# EAGLE design 8rgb-shifter (EAGLE 6.4)
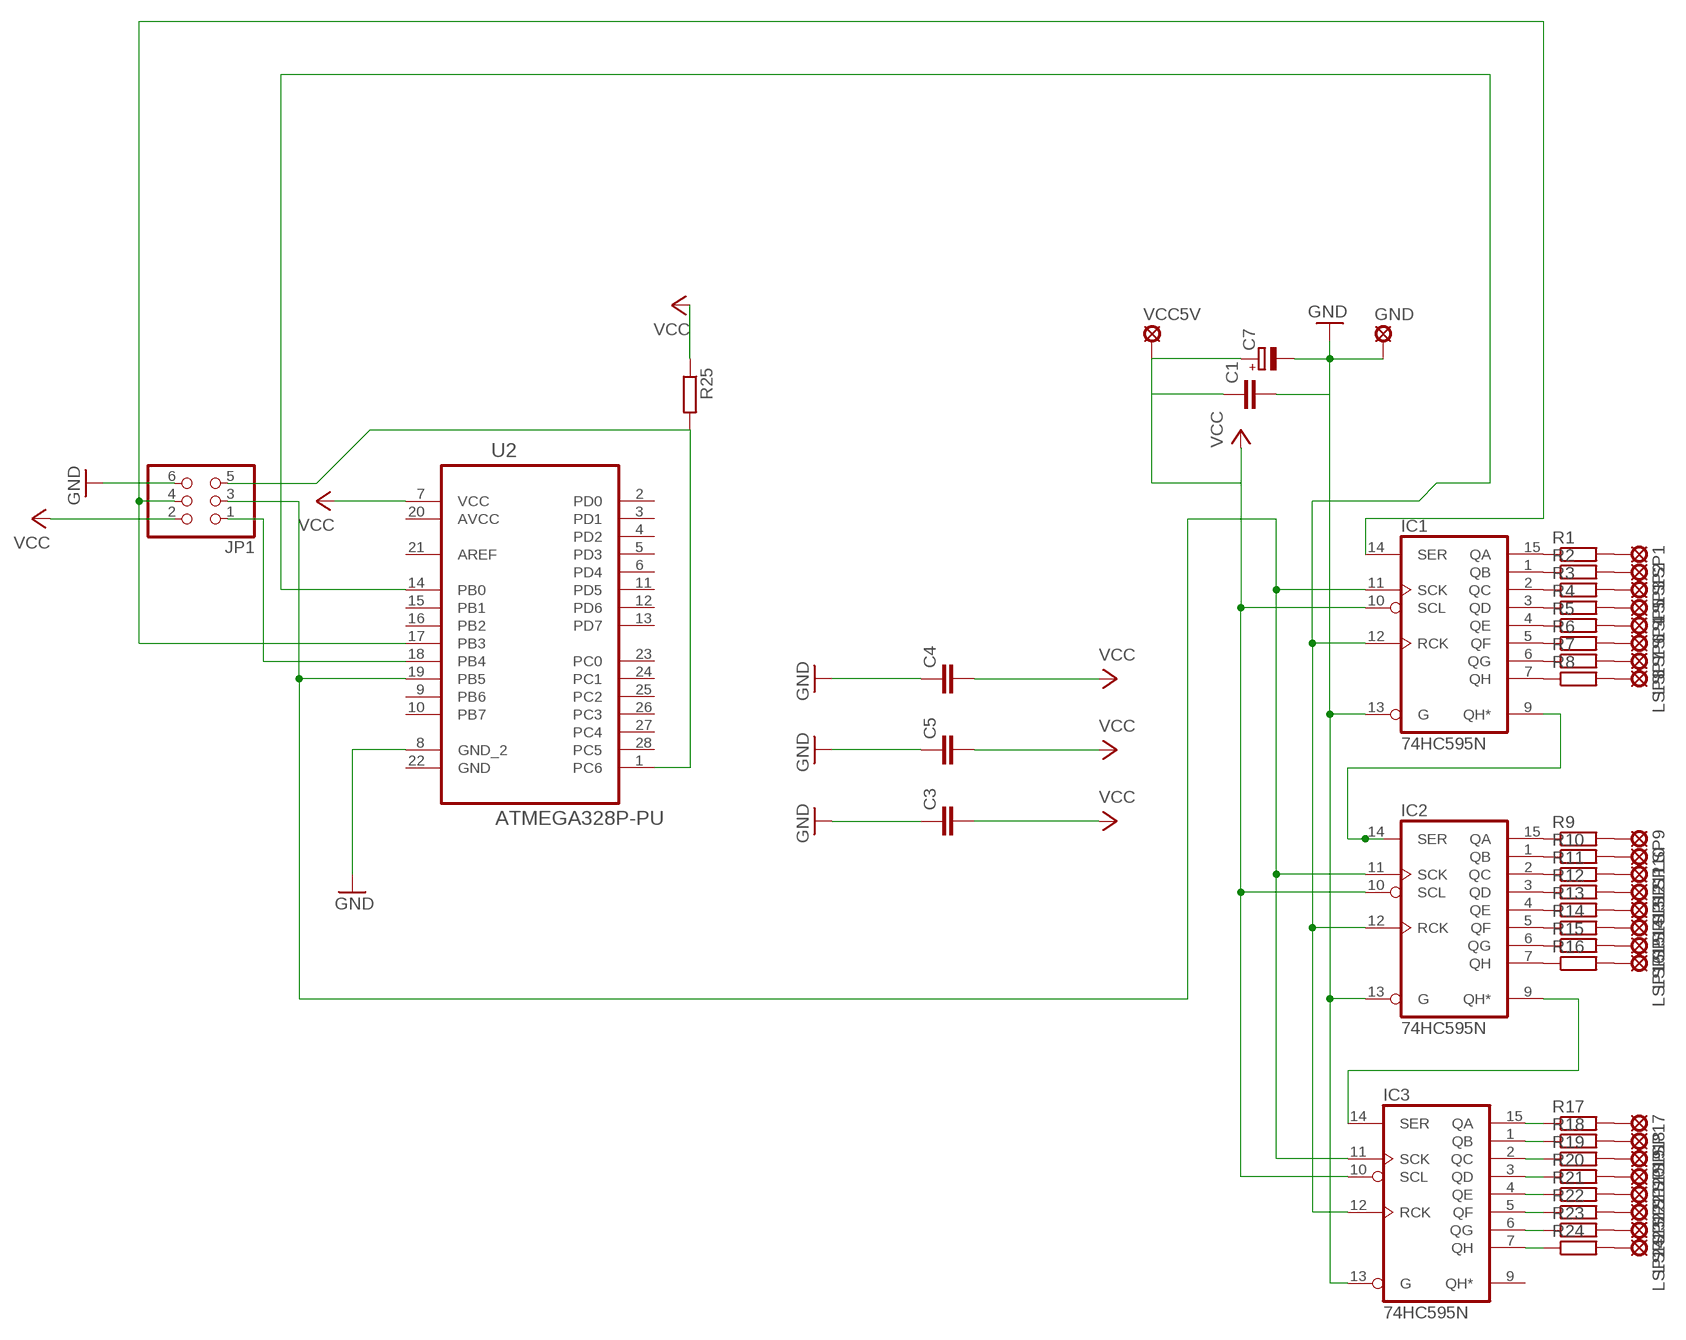
[diagram p0: schematic, sheet 1]

## Parts
C1  C-EU025-025X050  [C025-025X050]
C3  C-EU025-025X050  [C025-025X050]
C4  C-EU025-025X050  [C025-025X050]
C5  C-EU025-025X050  [C025-025X050]
C7  CPOL-EUE2,5-6E  [E2,5-6E]
GND  LSP10  [LSP10]
IC1  74HC595N  [DIL16]
IC2  74HC595N  [DIL16]
IC3  74HC595N  [DIL16]
JP1  PINHD-2X3  [2X03]
LSP1  LSP10  [LSP10]
LSP2  LSP10  [LSP10]
LSP3  LSP10  [LSP10]
LSP4  LSP10  [LSP10]
LSP5  LSP10  [LSP10]
LSP6  LSP10  [LSP10]
LSP7  LSP10  [LSP10]
LSP8  LSP10  [LSP10]
LSP9  LSP10  [LSP10]
LSP10  LSP10  [LSP10]
LSP11  LSP10  [LSP10]
LSP12  LSP10  [LSP10]
LSP13  LSP10  [LSP10]
LSP14  LSP10  [LSP10]
LSP15  LSP10  [LSP10]
LSP16  LSP10  [LSP10]
LSP17  LSP10  [LSP10]
LSP18  LSP10  [LSP10]
LSP19  LSP10  [LSP10]
LSP20  LSP10  [LSP10]
LSP21  LSP10  [LSP10]
LSP22  LSP10  [LSP10]
LSP23  LSP10  [LSP10]
LSP24  LSP10  [LSP10]
R1  R-EU_0204/2V  [0204V]
R2  R-EU_0204/2V  [0204V]
R3  R-EU_0204/2V  [0204V]
R4  R-EU_0204/2V  [0204V]
R5  R-EU_0204/2V  [0204V]
R6  R-EU_0204/2V  [0204V]
R7  R-EU_0204/2V  [0204V]
R8  R-EU_0204/2V  [0204V]
R9  R-EU_0204/2V  [0204V]
R10  R-EU_0204/2V  [0204V]
R11  R-EU_0204/2V  [0204V]
R12  R-EU_0204/2V  [0204V]
R13  R-EU_0204/2V  [0204V]
R14  R-EU_0204/2V  [0204V]
R15  R-EU_0204/2V  [0204V]
R16  R-EU_0204/2V  [0204V]
R17  R-EU_0204/2V  [0204V]
R18  R-EU_0204/2V  [0204V]
R19  R-EU_0204/2V  [0204V]
R20  R-EU_0204/2V  [0204V]
R21  R-EU_0204/2V  [0204V]
R22  R-EU_0204/2V  [0204V]
R23  R-EU_0204/2V  [0204V]
R24  R-EU_0204/2V  [0204V]
R25  R-EU_0204/7  [0204/7]
U2  ATMEGA328P-PU  [DIP254P762X457-28]
VCC5V  LSP10  [LSP10]

## Nets
GND: C4.1 JP1.6 U2.8(GND_2)
N$1: JP1.1 U2.18(PB4)
N$2: IC1.11(SCK) IC2.11(SCK) IC3.11(SCK) JP1.3 U2.19(PB5)
N$3: LSP1.MP R1.2
N$4: IC1.9(QH*) IC2.14(SER)
N$5: IC2.9(QH*) IC3.14(SER)
N$6: LSP17.MP R17.2
N$7: JP1.5 R25.2 U2.1(PC6)
N$8: IC1.14(SER) JP1.4 U2.17(PB3)
N$10: IC1.15(QA) R1.1
N$12: IC1.1(QB) R2.1
N$13: IC1.2(QC) R3.1
N$14: IC1.3(QD) R4.1
N$15: IC1.4(QE) R5.1
N$16: IC1.5(QF) R6.1
N$17: IC1.6(QG) R7.1
N$18: IC1.7(QH) R8.1
N$19: IC2.15(QA) R9.1
N$20: IC2.1(QB) R10.1
N$21: IC2.2(QC) R11.1
N$22: IC2.3(QD) R12.1
N$23: IC2.4(QE) R13.1
N$24: IC2.5(QF) R14.1
N$25: IC2.6(QG) R15.1
N$26: IC2.7(QH) R16.1
N$27: IC3.15(QA) R17.1
N$28: IC3.1(QB) R18.1
N$29: IC3.2(QC) R19.1
N$30: IC3.3(QD) R20.1
N$31: IC3.4(QE) R21.1
N$32: IC3.5(QF) R22.1
N$33: IC3.6(QG) R23.1
N$34: IC3.7(QH) R24.1
N$57: LSP2.MP R2.2
N$58: LSP3.MP R3.2
N$59: LSP4.MP R5.2
N$60: LSP5.MP R4.2
N$61: LSP6.MP R6.2
N$62: LSP7.MP R7.2
N$63: LSP8.MP R8.2
N$64: LSP9.MP R9.2
N$65: LSP10.MP R10.2
N$66: LSP12.MP R12.2
N$67: LSP13.MP R13.2
N$68: LSP14.MP R14.2
N$69: LSP15.MP R15.2
N$70: LSP11.MP R11.2
N$71: LSP16.MP R16.2
N$72: LSP18.MP R18.2
N$73: LSP19.MP R19.2
N$74: LSP20.MP R20.2
N$75: LSP21.MP R21.2
N$76: LSP23.MP R23.2
N$77: LSP24.MP R24.2
N$78: LSP22.MP R22.2
N$104: C1.2 C3.1 C5.1 C7.- GND.MP IC1.13(G) IC2.13(G) IC3.13(G) ; supply symbol labelled GND
N$110: IC1.12(RCK) IC2.12(RCK) IC3.12(RCK) U2.14(PB0)
VCC: C1.1 C3.2 C4.2 C5.2 C7.+ IC1.10(SCL) IC2.10(SCL) IC3.10(SCL) JP1.2 R25.1 U2.7(VCC) VCC5V.MP
Unconnected: IC3.9(QH*) U2.2(PD0) U2.3(PD1) U2.4(PD2) U2.5(PD3) U2.6(PD4) U2.9(PB6) U2.10(PB7) U2.11(PD5) U2.12(PD6) U2.13(PD7) U2.15(PB1) U2.16(PB2) U2.21(AREF) U2.22(GND) U2.23(PC0) U2.24(PC1) U2.25(PC2) U2.26(PC3) U2.27(PC4) U2.28(PC5)

## Power pins joined to a net without a drawn wire
AVCC: U2.20(AVCC)
N$104: IC1.8(GND) IC2.8(GND) IC3.8(GND)
VCC: IC1.16(VCC) IC2.16(VCC) IC3.16(VCC)

## Library data of the parts
C1 C3-C5 = resistor:C-EU: CAPACITOR, European symbol
C7 = rcl:CPOL-EU: POLARIZED CAPACITOR, European symbol
GND LSP1-LSP24 VCC5V = solpad:LSP10: SOLDER PAD drill 1.0 mm, distributor Buerklin, 12H555
IC1-IC3 = 74xx-eu:74*595: 8-bit SHIFT REGISTER, output latch
JP1 = pinhead:PINHD-2X3: PIN HEADER
R1-R24 = rcl:R-EU_: RESISTOR, European symbol
R25 = resistor:R-EU_: RESISTOR, European symbol
U2 = Atmel_By_element14_Batch_1:ATMEGA328P-PU: 8-bit Microcontroller with In-System Programmable Flash; MPN: ATMEGA328P-PU; OC_FARNELL: 1715487; OC_NEWARK: 15R0268; PACKAGE: PDIP-28; SUPPLIER: Atmel

## Board
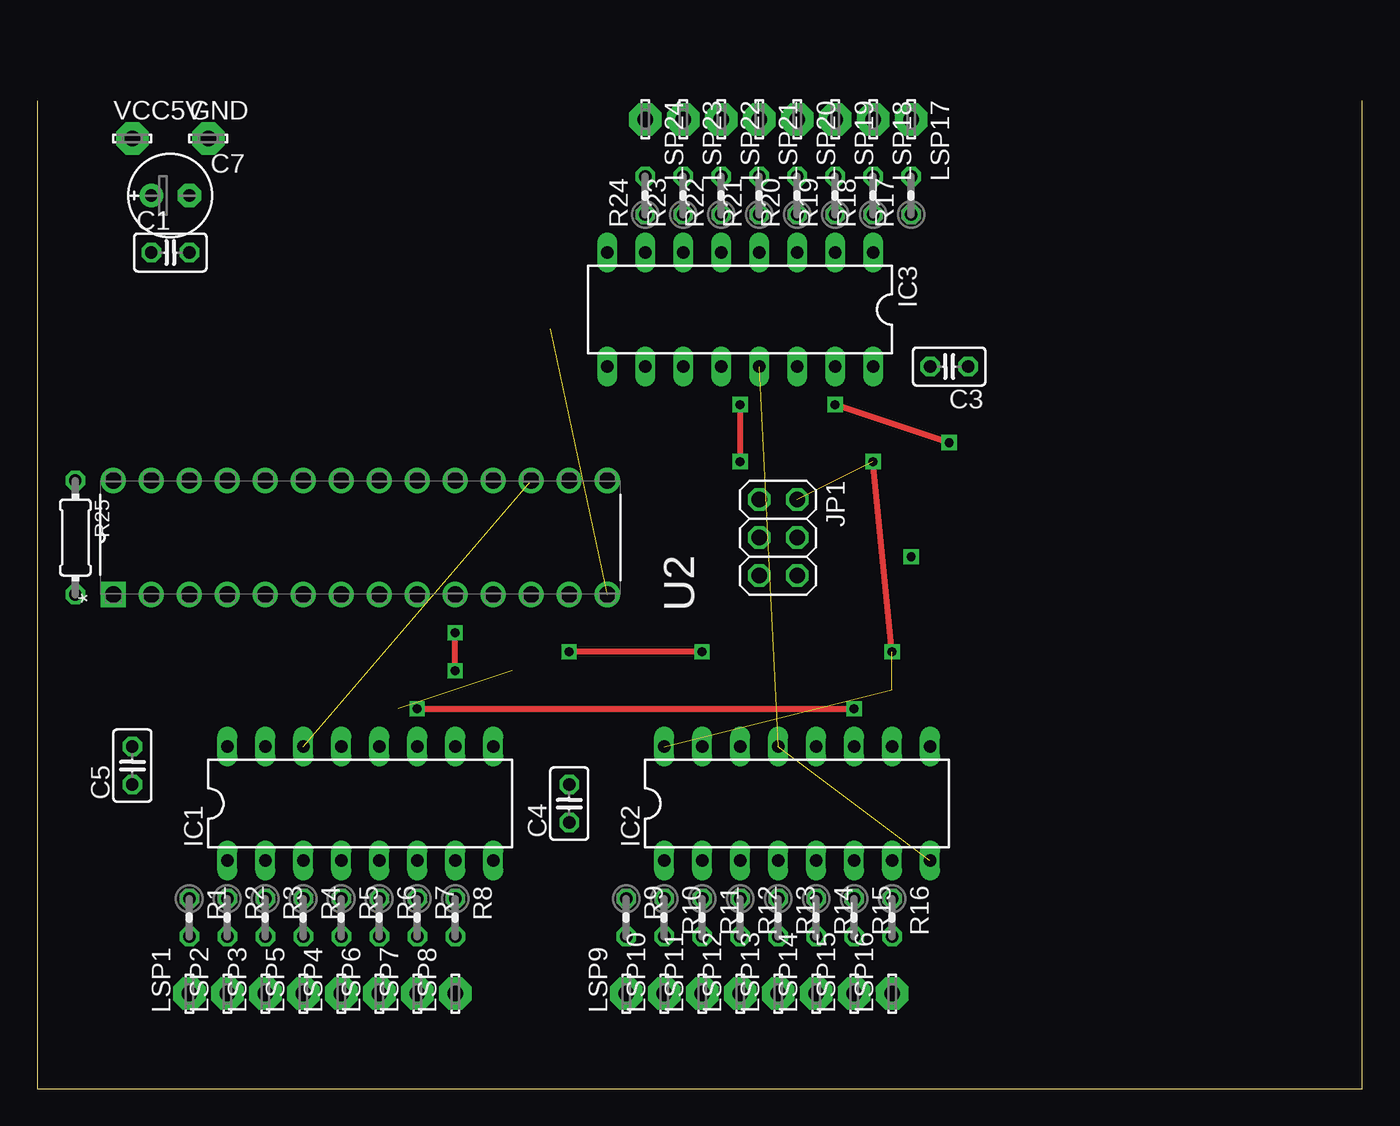
[diagram p1: board, top side]
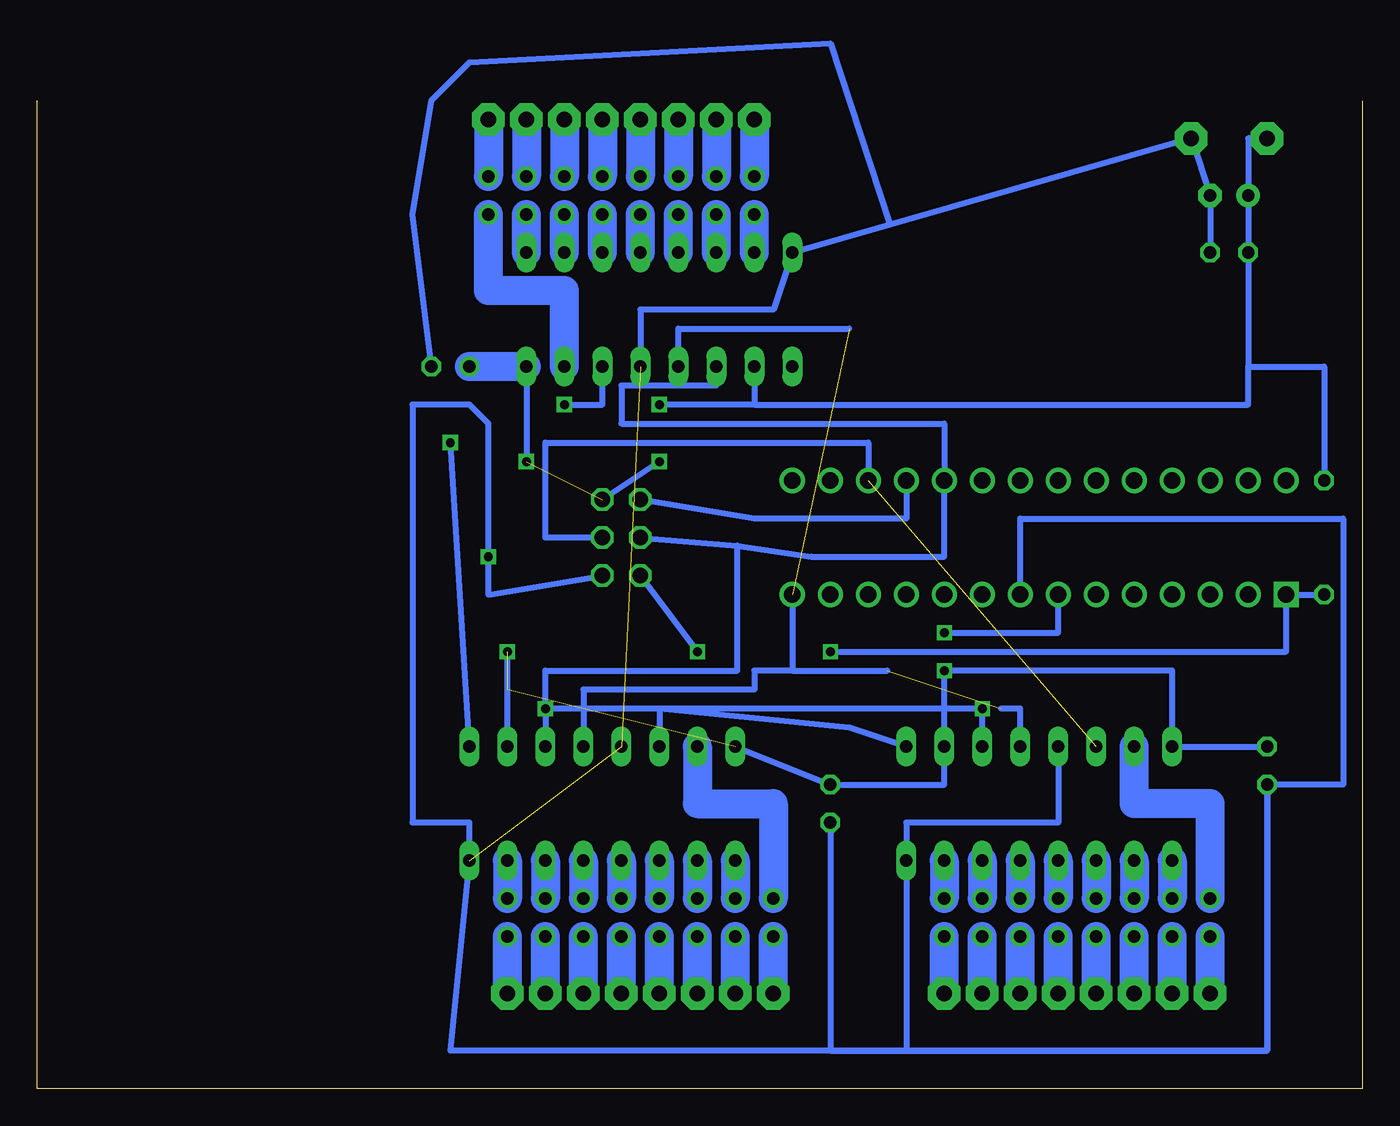
[diagram p2: board, bottom side, seen from below]

Size 88.57 x 66.03 mm. Coordinates in mm from the lower left corner, seen from the top.
Outline: 88.57,66.03 88.57,0 0,0 0,66.03
Copper layers (1*16): Top 0.035mm / dielectric 1.5mm / Bottom 0.035mm
Design rules "default *": minimum track width 10mil, minimum drill 24mil, track to track 8mil, track to pad 8mil, pad to pad 8mil, via to via 8mil, smd to smd 8mil, copper to edge 40mil, drill to drill 8mil, minimum pad ring 10mil, minimum via ring 8mil, stop-mask expansion 4mil, vias tented up to drill 0mil, thermal gap 10mil

### Footprints (pad centres in the part's own frame; a part is rotated, then mirrored left to right if it is on the bottom)
C025-025X050 = drill 0.813 octagon: 1 -1.27,0; 2 1.27,0
E2,5-6E = drill 0.813 pad 1.575: + -1.27,0 | drill 0.813 pad 1.575 octagon: - 1.27,0
LSP10 = drill 1.016 pad 2.159 octagon: MP 0,0
DIL16 = drill 0.813 long: 1 -8.89,-3.81; 2 -6.35,-3.81; 3 -3.81,-3.81; 4 -1.27,-3.81; 5 1.27,-3.81; 6 3.81,-3.81; 7 6.35,-3.81; 8 8.89,-3.81; 9 8.89,3.81; 10 6.35,3.81; 11 3.81,3.81; 12 1.27,3.81; 13 -1.27,3.81; 14 -3.81,3.81; 15 -6.35,3.81; 16 -8.89,3.81
2X03 = drill 1.016 octagon: 1 -2.54,-1.27; 2 -2.54,1.27; 3 0,-1.27; 4 0,1.27; 5 2.54,-1.27; 6 2.54,1.27
0204V = drill 0.813 octagon: 1 -1.27,0; 2 1.27,0
0204/7 = drill 0.813 octagon: 1 -3.81,0; 2 3.81,0
DIP254P762X457-28 = drill 1.118 square: 1 -7.62,33.02 | drill 1.118: 2 -7.62,30.48; 3 -7.62,27.94; 4 -7.62,25.4; 5 -7.62,22.86; 6 -7.62,20.32; 7 -7.62,17.78; 8 -7.62,15.24; 9 -7.62,12.7; 10 -7.62,10.16; 11 -7.62,7.62; 12 -7.62,5.08; 13 -7.62,2.54; 14 -7.62,0; 15 0,0; 16 0,2.54; 17 0,5.08; 18 0,7.62; 19 0,10.16; 20 0,12.7; 21 0,15.24; 22 0,17.78; 23 0,20.32; 24 0,22.86; 25 0,25.4; 26 0,27.94; 27 0,30.48; 28 0,33.02

### Placement (x,y rotation side)
C1  8.89,55.88 0 top
C3  60.96,48.26 180 top
C4  35.56,19.05 90 top
C5  6.35,21.59 90 top
C7  8.89,59.69 0 top
GND  11.43,63.5 0 top
IC1  21.59,19.05 0 top
IC2  50.8,19.05 0 top
IC3  46.99,52.07 180 top
JP1  49.53,36.83 270 top
LSP1  10.16,6.35 90 top
LSP2  12.7,6.35 90 top
LSP3  15.24,6.35 90 top
LSP4  20.32,6.35 90 top
LSP5  17.78,6.35 90 top
LSP6  22.86,6.35 90 top
LSP7  25.4,6.35 90 top
LSP8  27.94,6.35 90 top
LSP9  39.37,6.35 90 top
LSP10  41.91,6.35 90 top
LSP11  44.45,6.35 90 top
LSP12  46.99,6.35 90 top
LSP13  49.53,6.35 90 top
LSP14  52.07,6.35 90 top
LSP15  54.61,6.35 90 top
LSP16  57.15,6.35 90 top
LSP17  58.42,64.77 270 top
LSP18  55.88,64.77 270 top
LSP19  53.34,64.77 270 top
LSP20  50.8,64.77 270 top
LSP21  48.26,64.77 270 top
LSP22  45.72,64.77 270 top
LSP23  43.18,64.77 270 top
LSP24  40.64,64.77 270 top
R1  10.16,11.43 270 top
R2  12.7,11.43 270 top
R3  15.24,11.43 270 top
R4  17.78,11.43 270 top
R5  20.32,11.43 270 top
R6  22.86,11.43 270 top
R7  25.4,11.43 270 top
R8  27.94,11.43 270 top
R9  39.37,11.43 270 top
R10  41.91,11.43 270 top
R11  44.45,11.43 270 top
R12  46.99,11.43 270 top
R13  49.53,11.43 270 top
R14  52.07,11.43 270 top
R15  54.61,11.43 270 top
R16  57.15,11.43 270 top
R17  58.42,59.69 90 top
R18  55.88,59.69 90 top
R19  53.34,59.69 90 top
R20  50.8,59.69 90 top
R21  48.26,59.69 90 top
R22  45.72,59.69 90 top
R23  43.18,59.69 90 top
R24  40.64,59.69 90 top
R25  2.54,36.83 270 top
U2  38.1,40.64 90 top
VCC5V  6.35,63.5 0 top

### Tracks (layer width: path | path; a pad name or v marks a point on that pad's centre or on a via)
GND
  Bottom 0.406: U2.8 22.86,38.1 1.27,38.1 1.27,20.32 6.35,20.32 6.35,2.54 35.56,2.54 | C4.1 35.56,2.54 | 35.56,2.54 60.96,2.54 59.69,15.24 59.69,17.78 63.5,17.78 63.5,45.72 59.69,45.72 58.42,44.45 58.42,33.02 JP1.6
N$1
  Bottom 0.406: U2.18 30.48,38.1 40.64,38.1 JP1.1
N$2  (via drill 0.6)
  Top 0.406: v25.4,25.4 v54.61,25.4
  Bottom 0.406: JP1.3 41.76,36.29 | 41.76,36.29 36.83,35.56 27.94,35.56 U2.19 27.94,44.45 49.53,44.45 49.53,46.99 43.18,46.99 IC3.11 | IC1.11 v25.4,25.4 v54.61,25.4 | v54.61,25.4 IC2.11 | v54.61,25.4 54.61,27.94 41.76,27.94 41.76,36.29
N$3
  Bottom 1.93: LSP1.MP R1.2
N$4
  Bottom 0.406: IC1.9 34.29,24.13 46.99,25.4 IC2.14
N$5  (via drill 0.6)
  Top 0.406: v60.96,43.18 v53.34,45.72
  Bottom 0.406: IC2.9 v60.96,43.18 | v53.34,45.72 50.8,45.72 IC3.14
N$6
  Bottom 1.93: LSP17.MP R17.2
N$7  (via drill 0.6)
  Top 0.406: v44.45,29.21 v35.56,29.21
  Bottom 0.406: R25.2 U2.1 5.08,29.21 v35.56,29.21 | JP1.5 v44.45,29.21
N$8  (1 unrouted)
  Bottom 0.406: JP1.4 54.61,36.83 54.61,43.18 33.02,43.18 U2.17
N$10
  Bottom 1.93: R1.1 10.16,19.05 15.24,19.05 IC1.15
N$11  (via drill 0.6)
  other vias: 58.42,35.56
N$12
  Bottom 1.93: IC1.1 R2.1
N$13
  Bottom 1.93: IC1.2 R3.1
N$14
  Bottom 1.93: IC1.3 R4.1
N$15
  Bottom 1.93: IC1.4 R5.1
N$16
  Bottom 1.93: IC1.5 R6.1
N$17
  Bottom 1.93: IC1.6 R7.1
N$18
  Bottom 1.93: IC1.7 R8.1
N$19
  Bottom 1.93: IC2.15 44.45,19.05 39.37,19.05 R9.1
N$20
  Bottom 1.93: IC2.1 R10.1
N$21
  Bottom 1.93: IC2.2 R11.1
N$22
  Bottom 1.93: IC2.3 R12.1
N$23
  Bottom 1.93: IC2.4 R13.1
N$24
  Bottom 1.93: IC2.5 R14.1
N$25
  Bottom 1.93: IC2.6 R15.1
N$26
  Bottom 1.93: IC2.7 R16.1
N$27
  Bottom 1.93: IC3.15 53.34,53.34 58.42,53.34 R17.1
N$28
  Bottom 1.93: IC3.1 R18.1
N$29
  Bottom 1.93: IC3.2 R19.1
N$30
  Bottom 1.93: IC3.3 R20.1
N$31
  Bottom 1.93: IC3.4 R21.1
N$32
  Bottom 1.93: IC3.5 R22.1
N$33
  Bottom 1.93: IC3.6 R23.1
N$34
  Bottom 1.93: IC3.7 R24.1
N$57
  Bottom 1.93: LSP2.MP R2.2
N$58
  Bottom 1.93: LSP3.MP R3.2
N$59
  Bottom 1.93: LSP4.MP R5.2
N$60
  Bottom 1.93: LSP5.MP R4.2
N$61
  Bottom 1.93: LSP6.MP R6.2
N$62
  Bottom 1.93: LSP7.MP R7.2
N$63
  Bottom 1.93: LSP8.MP R8.2
N$64
  Bottom 1.93: LSP9.MP R9.2
N$65
  Bottom 1.93: LSP10.MP R10.2
N$66
  Bottom 1.93: LSP12.MP R12.2
N$67
  Bottom 1.93: LSP13.MP R13.2
N$68
  Bottom 1.93: LSP14.MP R14.2
N$69
  Bottom 1.93: LSP15.MP R15.2
N$70
  Bottom 1.93: LSP11.MP R11.2
N$71
  Bottom 1.93: LSP16.MP R16.2
N$72
  Bottom 1.93: LSP18.MP R18.2
N$73
  Bottom 1.93: LSP19.MP R19.2
N$74
  Bottom 1.93: LSP20.MP R20.2
N$75
  Bottom 1.93: LSP21.MP R21.2
N$76
  Bottom 1.93: LSP23.MP R23.2
N$77
  Bottom 1.93: LSP24.MP R24.2
N$78
  Bottom 1.93: LSP22.MP R22.2
N$104  (2 unrouted)
  Bottom 0.406: C5.1 6.35,2.54 30.48,2.54 | IC1.13 20.32,17.78 30.48,17.78 IC1.8 30.48,2.54 | 30.48,2.54 60.96,2.54 IC2.8 | C1.2 C7.- GND.MP 31.56,57.75 | 31.56,57.75 IC3.8 39.37,52.07 48.26,52.07 IC3.13 | C3.1 63.5,58.42 62.23,66.04 59.69,68.58 35.56,69.85 31.56,57.75
N$110  (2 unrouted)
  Bottom 0.406: IC1.12 22.86,25.4 24.13,25.4 | 38.1,27.94 31.75,27.94 | U2.14 38.1,27.94 | 38.1,27.94 40.64,27.94 40.64,26.67 52.07,26.67 IC2.12 | IC3.12 45.72,50.8 34.29,50.8
VCC  (via drill 0.6)  (3 unrouted)
  Top 0.406: v57.15,29.21 v55.88,41.91 | v27.94,27.94 v27.94,30.48 | v46.99,45.72 v46.99,41.91
  Bottom 0.406: VCC5V.MP 7.62,63.5 C7.+ C1.1 7.62,48.26 | C5.2 IC1.16 12.7,27.94 v27.94,27.94 IC1.10 27.94,20.32 C4.2 IC2.16 | IC2.10 v57.15,29.21 | IC3.16 v55.88,41.91 | v27.94,30.48 20.32,30.48 U2.7 | 7.62,48.26 2.54,48.26 R25.1 | IC3.10 40.64,45.72 | 40.64,45.72 7.62,45.72 7.62,48.26 | 40.64,45.72 v46.99,45.72 | v46.99,41.91 JP1.2
  Bottom 1.93: IC3.16 C3.2